# EAGLE design synth-zodiac-comp-test-2 (EAGLE 9.6.2)
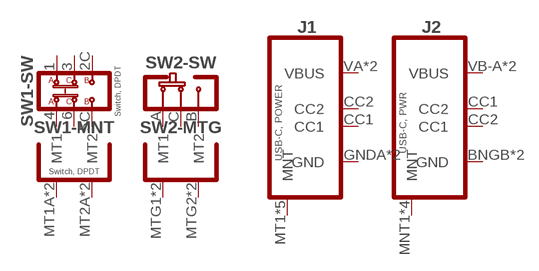
[diagram p0: schematic, sheet 1]

## Parts
J1  USB-C, POWER  USB-C-PWRGCT-4515  [GCT-USB4515-PANEL]
J2  USB-C, PWR  USB-C-PWR-SMT-PNL  [UJC-HP-3-SMT-TR-PANEL]
SW1  Switch, DPDT  SLIDE-DPDT-MNTPNL-SMD-TOGGLE-ONLY  [CK_OS202013MT5-PNL-SMT-2]
SW2  SLIDE-SPDT-MNTSS-12-F45-TH-PCB-2  [SS-12-F45-PNL-SMT-2]
Unconnected: J1.CC1 J1.CC2 J1.MT1(MNT) J1.MT2(MNT) J1.MT3(MNT) J1.MT4(MNT) J1.MTC(MNT) J2.CC1(CC2) J2.CC2(CC1) J2.MNT1(MNT) J2.MNT2(MNT) J2.MNT3(MNT) J2.MNT4(MNT) SW1.1(-SW:1A) SW1.2C(-SW:1B) SW1.3(-SW:1C) SW1.4(-SW:2A) SW1.5C(-SW:2B) SW1.6(-SW:2C) SW1.MT1A(-MNT:MT1) SW1.MT2A(-MNT:MT2) SW1.MT3A(-MNT:MT1) SW1.MT4A(-MNT:MT2) SW2.A(-SW:A) SW2.B(-SW:B) SW2.C(-SW:C) SW2.MTG1(-MTG:MT1) SW2.MTG2(-MTG:MT2) SW2.MTG3(-MTG:MT1) SW2.MTG4(-MTG:MT2)

## Power pins joined to a net without a drawn wire
GND: J1.GNDA(GND) J1.GNDB(GND) J2.BNGB(GND) J2.GNDA(GND)
VBUS: J1.VA(VBUS) J1.VB(VBUS) J2.VB-A(VBUS) J2.VB-B(VBUS)

## Library data of the parts
J1 = con-usb:USB-C-PWR: USB-C, Power Only; COST01: 0.70; COST10: 0.55; COST100: 0.45; MFR: GCT; MPN: USB4515
J2 = con-usb:USB-C-PWR: USB-C, Power Only; COST01: 1.05; COST10: 0.82; COST100: 0.70; MFR: CUI; MPN: UJC-HP-3-SMT-TR
SW1 = switch-thd:SLIDE-DPDT-MNT: DPDT Slide Switch with mounting pins; MFR: CK; MPN: OS202013MT5QN1
SW2 = switch-thd:SLIDE-SPDT-MNT: Slide Switch, SPDT; COST01: 0.15; COST10: 0.12; COST100: 0.12; MFR: Tayda; MPN: A-659/A-5111/A-5104

## Board
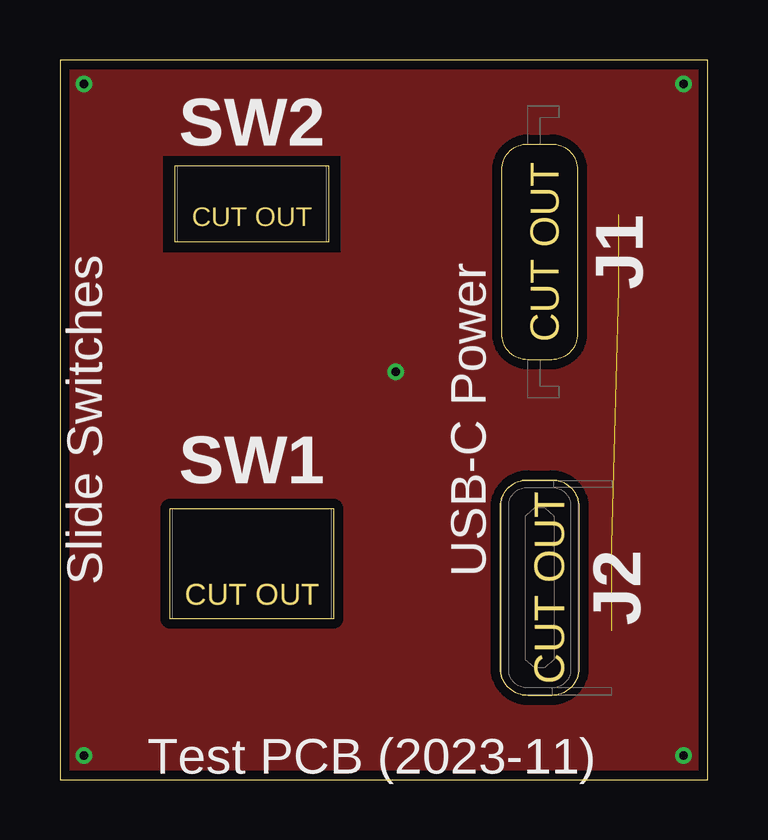
[diagram p1: board, top side]
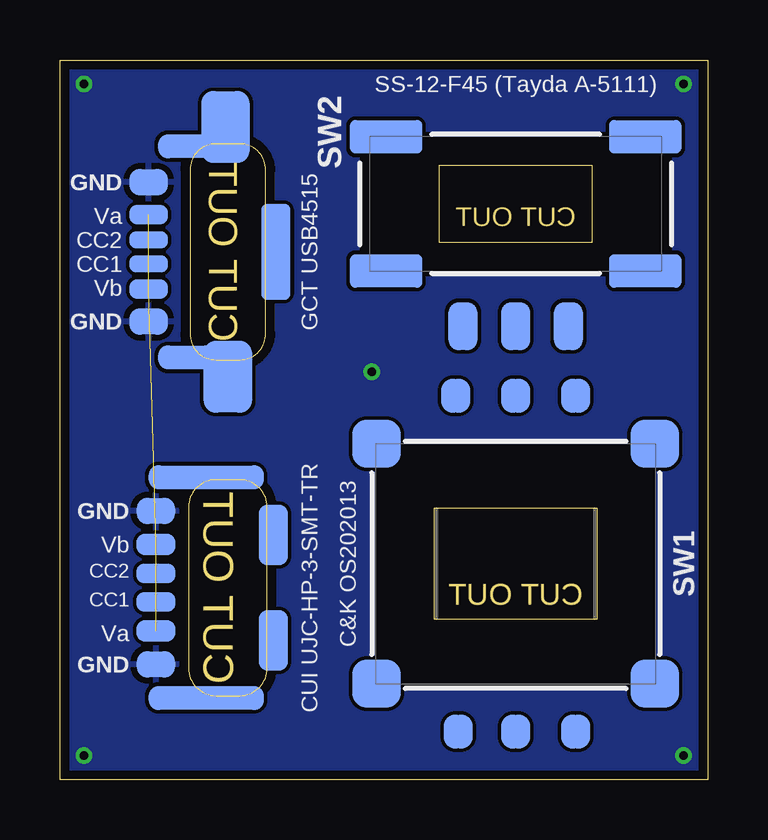
[diagram p2: board, bottom side, seen from below]

Size 27 x 30 mm. Coordinates in mm from the lower left corner, seen from the top.
Outline: 0,0 27,0 27,30 0,30 0,0
Copper layers (1*16): Top 0.0356mm / dielectric 1.5011mm / Bottom 0.0356mm
Design rules "OSH-CircuitMonkey *": minimum track width 6mil, minimum drill 12mil, track to track 6mil, track to pad 6mil, pad to pad 6mil, via to via 6mil, smd to smd 6mil, copper to edge 15mil, drill to drill 6mil, minimum pad ring 7mil, minimum via ring 7mil, stop-mask expansion 3mil, vias tented up to drill 15mil, thermal gap 10mil

### Footprints (pad centres in the part's own frame; a part is rotated, then mirrored left to right if it is on the bottom)
GCT-USB4515-PANEL = smd 0.7 x 1.6 bottom: CC1 -0.5,-3.3; CC2 0.5,-3.3 | smd 1.1 x 1.6 bottom: GNDA 2.9,-3.3; GNDB -2.9,-3.3 | smd 3 x 2 bottom: MT1 -5.2,0; MT2 5.2,-0.1 | smd 1 x 2.4 bottom: MT3 -4.4,-1.7; MT4 4.4,-1.7 | smd 4 x 1.2 bottom: MTC 0,2 | smd 0.8 x 1.6 bottom: VA 1.55,-3.3; VB -1.55,-3.3
UJC-HP-3-SMT-TR-PANEL = smd 1.1 x 1.6 bottom: BNGB 3.2,-3; GNDA -3.2,-3 | smd 0.8 x 1.6 bottom: CC1 -0.6,-3; CC2 0.6,-3 | smd 1 x 4.8 bottom: MNT1 -4.6,-0.9; MNT2 4.6,-0.9 | smd 2.5 x 1.2 bottom: MNT3 -2.2,1.9; MNT4 2.2,1.9 | smd 0.9 x 1.6 bottom: VB-A -1.8,-3; VB-B 1.8,-3
CK_OS202013MT5-PNL-SMT-2 = smd 1.2 x 1.4 bottom: 1 -2.5,7; 2C 0,7; 3 2.5,7; 4 -2.5,-7; 5C 0,-7; 6 2.4,-7 | smd 2 x 2 bottom: MT1A -5.8,-5; MT2A 5.8,-5; MT3A -5.8,5; MT4A 5.8,5
SS-12-F45-PNL-SMT-2 = smd 1.2 x 2 bottom: A -2.2,-5.1; B 2.2,-5.1; C 0,-5.1 | smd 3 x 1.4 bottom: MTG1 -5.4,2.8; MTG2 5.4,2.8; MTG3 -5.4,-2.8; MTG4 5.4,-2.8

### Placement (x,y rotation side)
J1  20,22 90 top
J2  20,8 90 top
SW1  8,9 0 top
SW2  8,24 0 top

### Tracks (layer width: path | path; a pad name or v marks a point on that pad's centre or on a via)
GND  (via drill 0.35)
  other vias: 1,1 26,1 26,29 1,29 14,17
  pour Top: 0,0 0,30 27,30 27,0
  pour Bottom: 0,0 0,30 27,30 27,0
VBUS  (3 unrouted)

### Text on the board
tPlace: Slide Switches | USB-C Power | Test PCB (2023-11)
bPlace: SS-12-F45 (Tayda A-5111) | GCT USB4515 | C&K OS202013 | CUI UJC-HP-3-SMT-TR